# EAGLE schematic main-wleonardo (EAGLE 7.7.0)
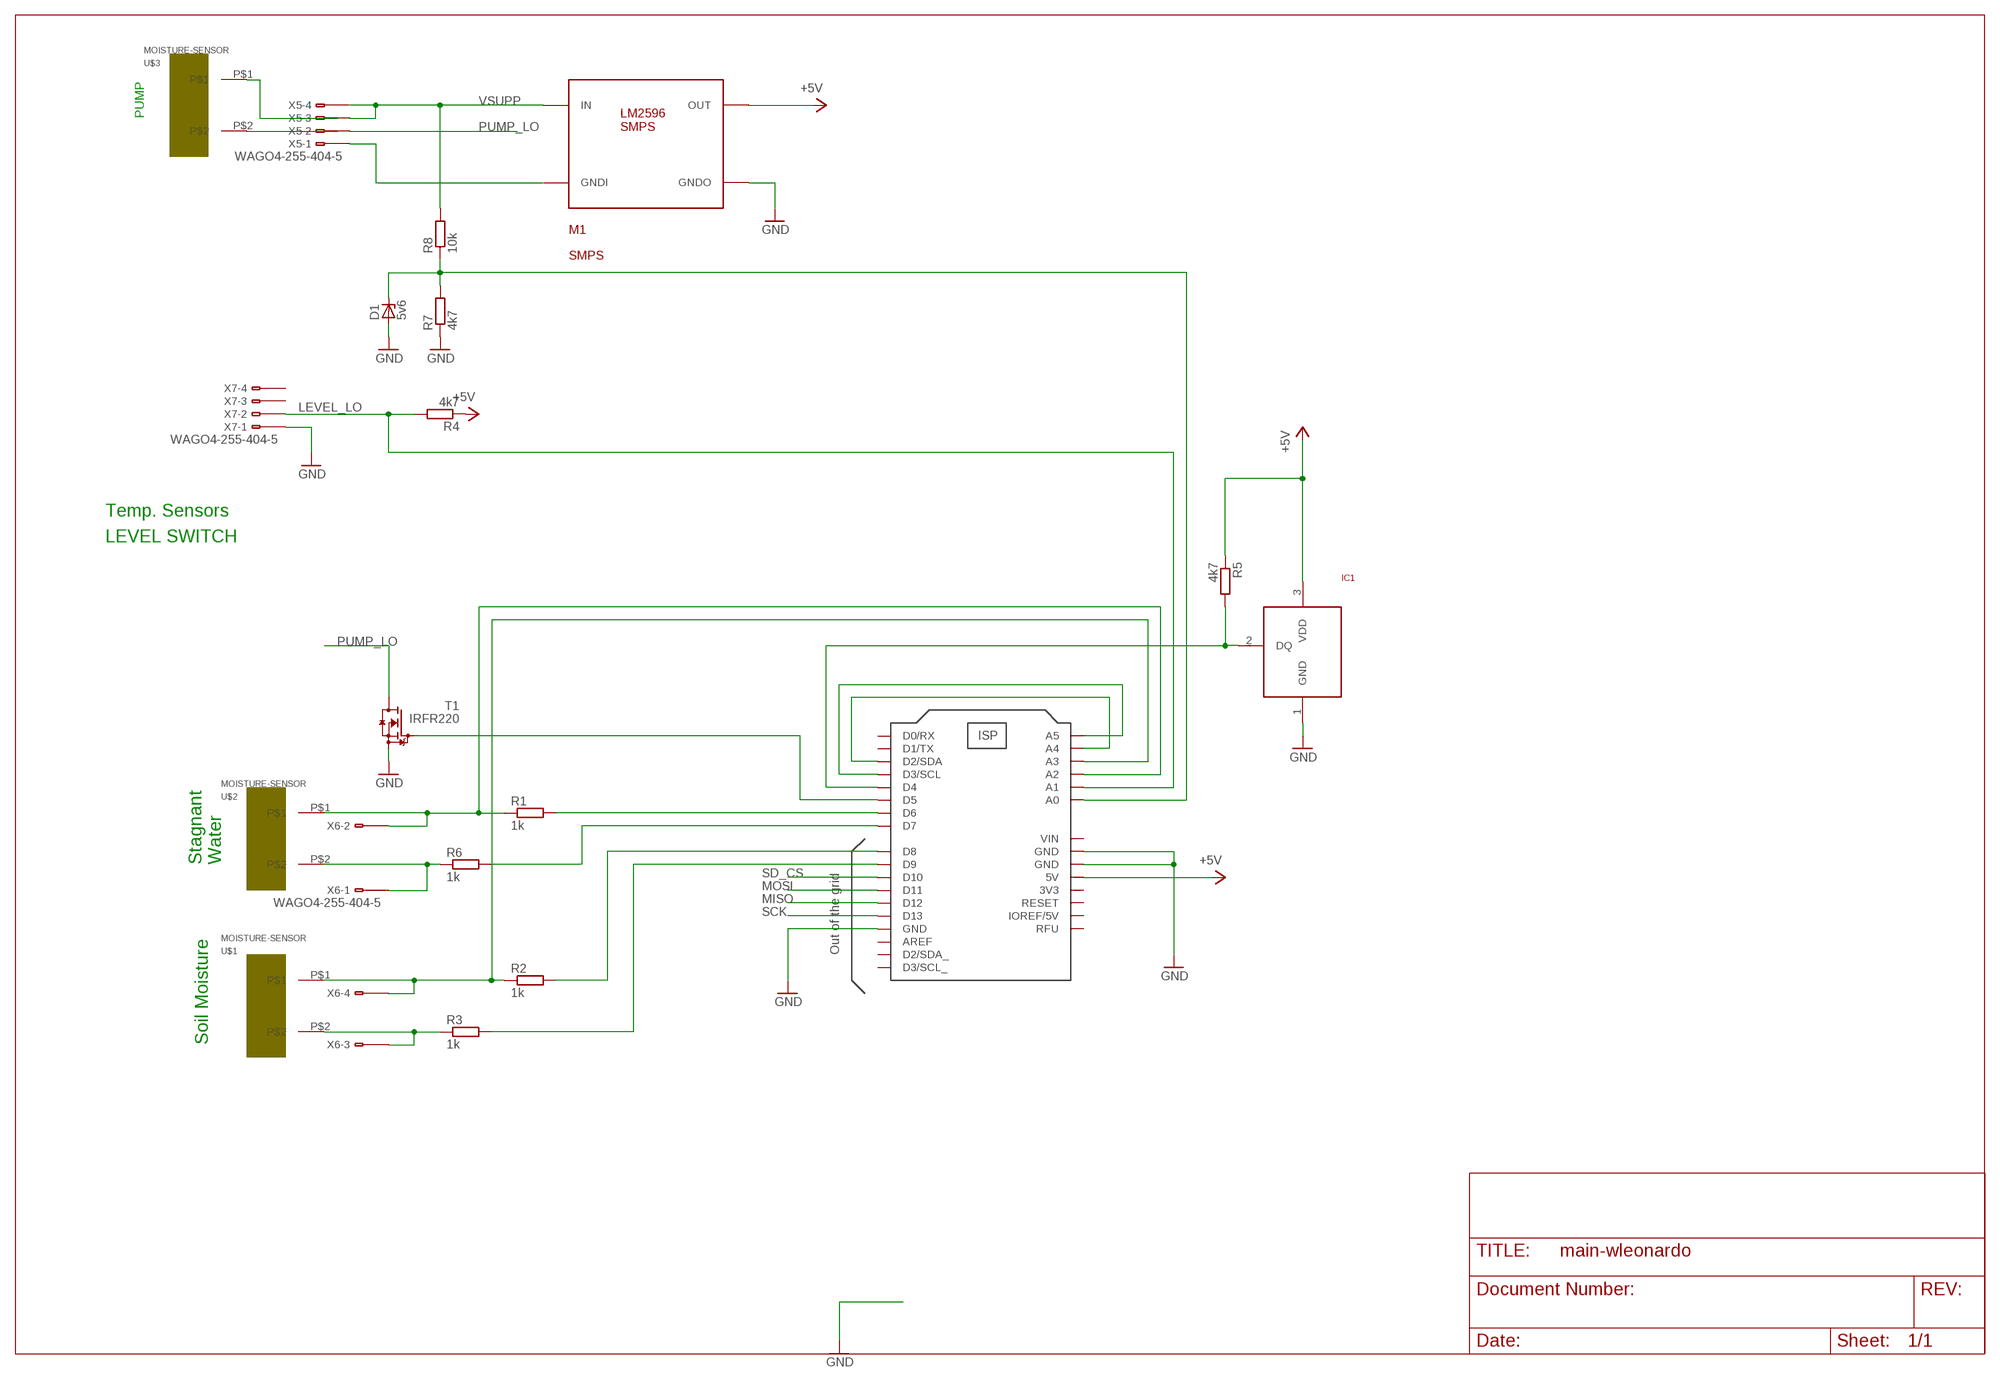
[diagram p0: schematic, sheet 1]

## Parts
D1  5v6  ZENER-DIODESOT23  [SOT23]
IC1  PAPP_DS1820  [PAPP_TO92-]
LEONARDO  SPARKFUN-BOARDS_ARDUINO-LEONARDO-OUTLINE  [SPARKFUN-BOARDS_ARDUINO_R3]
M1  SMPS  [SMPS-1]
R1  1k  R-EU_R0805  [R0805]
R2  1k  R-EU_R0805  [R0805]
R3  1k  R-EU_R0805  [R0805]
R4  4k7  R-EU_R0805  [R0805]
R5  4k7  R-EU_R0805  [R0805]
R6  1k  R-EU_R0805  [R0805]
R7  4k7  R-EU_R0805  [R0805]
R8  10k  R-EU_R0805  [R0805]
T1  IRFR220  [TO252]
U$1  MOISTURE-SENSOR  [MOISTURE-SENSOR]
U$2  MOISTURE-SENSOR  [MOISTURE-SENSOR]
U$3  MOISTURE-SENSOR  [MOISTURE-SENSOR]
X5  WAGO4-255-404-5  [255-404-5]
X6  WAGO4-255-404-5  [255-404-5]
X7  WAGO4-255-404-5  [255-404-5]

## Nets
1W-DATA: IC1.2(DQ) LEONARDO.D4 R5.2
+5V: IC1.3(VDD) LEONARDO.5V M1.P$7(OUT) M1.P$8(OUT) R4.1 R5.1
GND: D1.1(A) IC1.1(GND) LEONARDO.GND@1(GND) LEONARDO.GND@2(GND) LEONARDO.GND@3(GND) M1.P$5(GNDO) M1.P$6(GNDO) R7.1 T1.2(S) X7.B1(-1:B1)
LEVEL_LO: LEONARDO.A1 R4.2 X7.B2(-2:B1)
MISO: LEONARDO.D12
MOSI: LEONARDO.D11
N$1: LEONARDO.D5 T1.1(G)
N$2: M1.P$1(GNDI) M1.P$2(GNDI) X5.B1(-1:B1)
N$3: R6.1 U$2.P$2 X6.B1(-1:B1)
N$4: LEONARDO.D6 R1.2
N$5: D1.3(C) LEONARDO.A0 R7.2 R8.1
N$6: R3.1 U$1.P$2 X6.B3(-3:B1)
N$7: U$3.P$2 X5.A2(-2:A1)
N$8: U$3.P$1 X5.A3(-3:A1)
N$9: LEONARDO.A2 R1.1 U$2.P$1 X6.B2(-2:B1)
N$10: LEONARDO.D7 R6.2
N$11: LEONARDO.A3 R2.1 U$1.P$1 X6.B4(-4:B1)
N$12: LEONARDO.D9 R3.2
N$13: LEONARDO.A4 LEONARDO.D2(D2/SDA)
N$14: LEONARDO.A5 LEONARDO.D3(D3/SCL)
N$15: LEONARDO.D8 R2.2
PUMP_LO: T1.3(D) X5.B2(-2:B1)
SCK: LEONARDO.D13
SD_CS: LEONARDO.D10
VSUPP: M1.P$3(IN) M1.P$4(IN) R8.2 X5.B3(-3:B1) X5.B4(-4:B1)
Unconnected: LEONARDO.3.3V(3V3) LEONARDO.AREF LEONARDO.D0(D0/RX) LEONARDO.D1(D1/TX) LEONARDO.GND@4(RFU) LEONARDO.IOREF(IOREF/5V) LEONARDO.RESET@1(RESET) LEONARDO.SCL(D3/SCL_) LEONARDO.SDA(D2/SDA_) LEONARDO.VIN X5.A1(-1:A1) X5.A4(-4:A1) X6.A1(-1:A1) X6.A2(-2:A1) X6.A3(-3:A1) X6.A4(-4:A1) X7.A1(-1:A1) X7.A2(-2:A1) X7.A3(-3:A1) X7.A4(-4:A1) X7.B3(-3:B1) X7.B4(-4:B1)

## Notes on the sheet
- PUMP
- Temp. Sensors
- LEVEL SWITCH
- Stagnant
  Water
- Soil Moisture

## Library data of the parts
D1 = diode:ZENER-DIODE: Z-Diode
IC1 = plant:PAPP_DS1820: DS1820 1 wire temperature sensor
LEONARDO = plant:SPARKFUN-BOARDS_ARDUINO-LEONARDO-OUTLINE
M1 = papp:SMPS
R1-R8 = rcl:R-EU_: RESISTOR, European symbol
T1 = papp:IRFR220
U$1-U$3 = plant:MOISTURE-SENSOR
X5-X7 = con-wago:WAGO4-: WAGO Cage Clamp; MPN: 255-404; OC_FARNELL: unknown; OC_NEWARK: 28K9768